# Altium schematic sheet uproc_main.SchDoc
size 863 x 558 mm
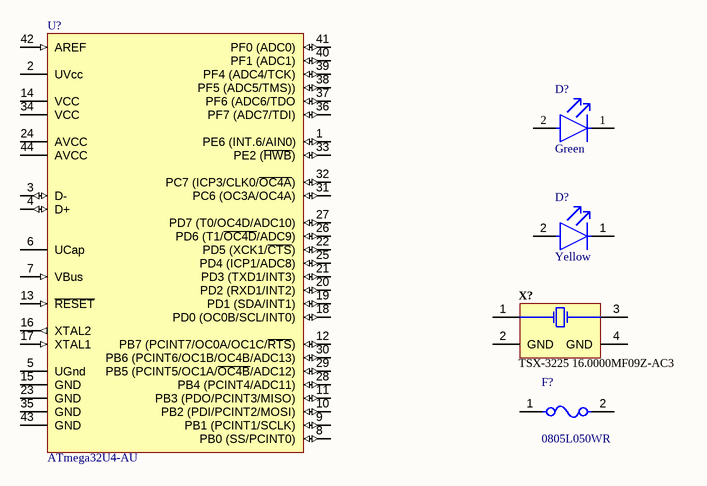
[diagram p0: uproc_main.SchDoc]

## Parts
(Parts that share a designator on the sheet are numbered #1, #2 ... from top to bottom, then left to right.)
D?#1  Green  [FP-LTST-C191KGKT-MFG]
D?#2  Yellow  [FP-LTST-C191KSKT-MFG]
F?  0805L050WR  [FP-0805L-MFG]
U?  ATmega32U4-AU  [44ML_M]
X?  TSX-3225 16.0000MF09Z-AC3  [EPSON-TSX-3225_V]

## Nets

Not connected (* = marked no-connect by the designer): D?#1 1(C) 2(A); D?#2 1(C) 2(A); F? 1 2; U? 1(PE6_(INT.6/AIN0)) 2(UVcc) 3(D-) 4(D+) 5(UGnd) 6(UCap) 7(VBus) 8(PB0_(SS/PCINT0)) 9(PB1_(PCINT1/SCLK)) 10(PB2_(PDI/PCINT2/MOSI)) 11(PB3_(PDO/PCINT3/MISO)) 12(PB7_(PCINT7/OC0A/OC1C/~{RTS})) 13(~{RESET}) 14(VCC) 15(GND) 16(XTAL2) 17(XTAL1) 18(PD0_(OC0B/SCL/INT0)) 19(PD1_(SDA/INT1)) 20(PD2_(RXD1/INT2)) 21(PD3_(TXD1/INT3)) 22(PD5_(XCK1/~{CTS})) 23(GND) 24(AVCC) 25(PD4_(ICP1/ADC8)) 26(PD6_(T1/~{OC4D}/ADC9)) 27(PD7_(T0/OC4D/ADC10)) 28(PB4_(PCINT4/ADC11)) 29(PB5_(PCINT5/OC1A/~{OC4B}/ADC12)) 30(PB6_(PCINT6/OC1B/OC4B/ADC13)) 31(PC6_(OC3A/OC4A)) 32(PC7_(ICP3/CLK0/~{OC4A})) 33(PE2_(~{HWB})) 34(VCC) 35(GND) 36(PF7_(ADC7/TDI)) 37(PF6_(ADC6/TDO) 38(PF5_(ADC5/TMS))) 39(PF4_(ADC4/TCK)) 40(PF1_(ADC1)) 41(PF0_(ADC0)) 42(AREF) 43(GND) 44(AVCC); X? 1(X1) 2(GND) 3(X2) 4(GND)

## Notes on the sheet
- DWG. NO.
- REV.
- SHT.
- REVISION
- DESCRIPTION
- DATE
- APPROVED
- THIS DOCUMENT AND THE DATA DISCLOSED HEREIN OR HEREWITH IS THE PROPERTY OF ALTIUM LIMITED AND MAY BE FREELY DISTRIBUTED IN WHOLE. NO RIGHTS ARE RESERVED OR EXPRESS OR IMPLIED WARANTEE GIVEN.
- ENG:
- DSN:
- APPROVALS
- PROJECT
- DOCUMENT REVISION:
- DESIGN ITEM:
- CHK:
- BOM:
- REFERENCE DOCUMENTS
- PROJECT REVISION:
- TITLE
- FAB DWG:
- PCB DWG:
- ASSY DWG:
- SCALE:
- SIZE
- D
- CAGE CODE
- FILE NAME
- DWG NO.
- SHEET
- OF
- REV

## Library data of the parts
D?#1 = CMP-2000-05198-4: LED GREEN CLEAR SMD; NexarPartId: 549907; Manufacturer: Vishay Lite-On; Manufacturer Part Number: LTST-C191KGKT; Forward Voltage: 2V; Viewing Angle: 130°; Power Rating: 75mW; Number of LEDs: 1; Luminous Intensity: 35mcd; Forward Current: 20mA; Dominant Wavelength: 571nm; Lens Color: Clear, Colorless; Reverse Voltage: 5V; Wavelength: 574nm; Description: Single Color LED, Ultra Bright Green, Water Clear, 1.1mm; Shape: Rectangular; Optoelectronic Device Type: SINGLE COLOR LED; Overall Height: 0.55mm; Number of Pins: 2; Lens Transparency: Clear; Packaging: Tape and Reel; Number of Elements: 1; Schedule B: 8541402000, 8541402000; Height: 550µm; Case/Package: 0603; Illumination Color: Green; Depth: 800µm; Max Operating Temperature: 85°C; RoHS: Compliant; Lens Style: Clear; Lead Free: Lead Free; Length: 1.6mm; Mount: Surface Mount; Test Current: 20mA; Width: 800µm; Case Code (Imperial): 0603; Min Operating Temperature: -55°C; Case Code (Metric): 1608; Radiation Hardening: No; Power Dissipation: 75mW; Color: Green; Supplier: Digikey; Supplier Part Number: 160-1446-1-ND; Stock: 1664852; Pricing: 1=0.15, 10=0.1, 100=0.0688, 500=0.05448, 1000=0.04972, 2000=0.04564, 5000=0.04116, 10000=0.03835, 15000=0.0369, 25000=0.03527, 35000=0.03429, 50000=0.03334, 125000=0.03124, 250000=0.02993 (USD); Mounting Technology: Surface Mount; Pins: 2; Color@wavelength: Green; Terminal Finish: Tin; Luminous Intensity-Nom: 35mcd; Channels: 1; JESD-609 Code: e3; Reverse Voltage-Max: 5V; Size: 1.1mm; Terminal Pitch: 1.5mm; Reach SVHC Compliant: Yes; RoHS Compliant: Yes; ComponentLink1URL: https://datasheet.ciiva.com:443/pdfs/VipMasterIC/IC/LITE/LITE-S-A0003156116/LITE-S-A0003156116-1.pdf?src-supplier=IHS+Markit; ComponentLink1Description: https://datasheet.ciiva.com:443/pdfs/VipMasterIC/IC/LITE/LITE-S-A0003156116/LITE-S-A0003156116-1.pdf?src-supplier=IHS+Markit; ComponentLink2URL: https://datasheet.ciiva.com/2109/ltst-c191kgkt-2109973.pdf?src-supplier=Digikey; ComponentLink2Description: https://datasheet.ciiva.com/2109/ltst-c191kgkt-2109973.pdf?src-supplier=Digikey
D?#2 = CMP-22017-000025-1: LED YELLOW CLEAR SMD; Manufacturer: Vishay Lite-On; Manufacturer Part Number: LTST-C191KSKT; Dominant Wavelength: 597nm; Power Rating: 75mW; Number of LEDs: 1; Lens Style: Diffused; Forward Current: 30mA; Test Current: 20mA; Forward Voltage: 2.4V; Wavelength: 588nm; Viewing Angle: 130°; Lens Color: Colorless; Reverse Voltage: 5V; Luminous Intensity: 180mcd; Description: Single Color LED, Yellow, Water Clear, 1.1mm; Shape: Rectangular; Optoelectronic Device Type: SINGLE COLOR LED; Luminous Intensity-Nom: 104mcd; Overall Height: 0.55mm; Case Code (Imperial): 0603; Width: 0.8mm; Power Dissipation: 75mW; Length: 1.6mm; Illumination Color: Yellow; Number of Pins: 2; Case Code (Metric): 1608; Mount: Surface Mount; Number of Elements: 1; Height: 0.55mm; Lens Transparency: Clear; Depth: 0.8mm; Min Operating Temperature: -55°C; Case/Package: 0603; Radiation Hardening: No; Max Operating Temperature: 85°C; Package Quantity: 1; Packaging: Tape and Reel; Lead Free: Lead Free; Color: Yellow; Supplier: Digikey; Supplier Part Number: 160-1448-1-ND; RoHS: Yes; Category: LEDs; Stock: 620459; Pricing: 1=0.15, 10=0.105, 100=0.0723, 500=0.05736, 1000=0.05238, 2000=0.04813, 5000=0.04344, 10000=0.0405, 15000=0.03899, 25000=0.03728, 35000=0.03627, 50000=0.03527, 125000=0.03308, 250000=0.03171 (USD); Mounting Technology: Surface Mount; Pins: 2; Color@wavelength: Yellow; Terminal Finish: Tin; JESD-609 Code: e3; Channels: 1; Reverse Voltage-Max: 5V; Size: 1.1mm; Terminal Pitch: 1.5mm; Reach SVHC Compliant: Yes; RoHS Compliant: Yes; ComponentLink1URL: https://datasheet.ciiva.com:443/pdfs/VipMasterIC/IC/LITE/LITE-S-A0008870965/LITE-S-A0008870965-1.pdf?src-supplier=IHS+Markit; ComponentLink1Description: https://datasheet.ciiva.com:443/pdfs/VipMasterIC/IC/LITE/LITE-S-A0008870965/LITE-S-A0008870965-1.pdf?src-supplier=IHS+Markit; ComponentLink2URL: https://datasheet.ciiva.com/12400/lite-on-ltst-c191kskt-190097-12400797.pdf?src-supplier=Mouser; ComponentLink2Description: https://datasheet.ciiva.com/12400/lite-on-ltst-c191kskt-190097-12400797.pdf?src-supplier=Mouser; ComponentLink3URL: https://datasheet.ciiva.com/11773/0900766b80dc02b3-11773512.pdf?src-supplier=Rs; ComponentLink3Description: https://datasheet.ciiva.com/11773/0900766b80dc02b3-11773512.pdf?src-supplier=Rs; ComponentLink4URL: https://datasheet.ciiva.com/16213/lite-on20ltst-c191kskt-16213725.pdf?src-supplier=Future+Electronics; ComponentLink4Description: https://datasheet.ciiva.com/16213/lite-on20ltst-c191kskt-16213725.pdf?src-supplier=Future+Electronics; ComponentLink5URL: https://datasheet.ciiva.com/15117/getdatasheetpartid-141495-15117732.pdf?src-supplier=Verical; ComponentLink5Description: https://datasheet.ciiva.com/15117/getdatasheetpartid-141495-15117732.pdf?src-supplier=Verical; ComponentLink6URL: https://datasheet.ciiva.com/2109/s-110-ltst-c191kskt-2109984.pdf?src-supplier=Digikey; ComponentLink6Description: https://datasheet.ciiva.com/2109/s-110-ltst-c191kskt-2109984.pdf?src-supplier=Digikey
F? = CMP-08606-000023-1: PTC RESET FUSE 6V 500MA 0805; Manufacturer: Littelfuse Inc.; Current Rating: 100A; Hold Current: 0.5A; Value: 0.15-0.85Ω; Trip Time: 0.1s; Trip Current: 1A; Device Class L2: PTC Resettable Fuses; Manufacturer Part Number: 0805L050WR; Digikey Description: PTC RESET FUSE 6V 500MA 0805; ComponentLink2URL: https://www.littelfuse.com/~/media/electronics/datasheets/resettable_ptcs/littelfuse_ptc_0805l_datasheet.pdf.pdf; Package: 0805L; RoHS: TRUE; Temperature Range Low: -40°C; Octopart: https://octopart.com/0805l050wr-littelfuse-673858; Resistance: 0.15-0.85Ω; ComponentLink2Description: Datasheet; Category: Fuse; Height: 1.25mm; Mouser Description: PTC Resettable Fuse 0.5A(hold) 1A(trip) 6VDC 100A 0.5W 0.1s 0.15Ohm SMD Solder Pad 0805 T/R; Ambient Temperature Range High: +85°C; Automotive: No; Device Class L3: unset; Lead Free: Yes; Temperature: -40°C to +85°C; Voltage Rating: 6V; Ambient Temperature Range Low: -40°C; Temperature Range High: +85°C; Device Class L1: Circuit Protection
U? = CMP-0095-00285-2: 8-bit AVR Microcontroller, 2.7-5.5V, 16MHz, 32KB Flash, 1KB EEPROM, 2.5KB SRAM, USB Controller, 44-pin TQFP, Industrial Grade (-40°C to 85°C), Ext Osc; Manufacturer: Microchip; Description: RISC Microcontroller, 8-Bit, FLASH, AVR RISC CPU, 16MHz, CMOS, PQFP44; Package Body Material: Plastic; Number of I/O Lines: 26; Package Equivalence Code: TQFP44,.47SQ,32; Power Supplies: 3/5; Max Supply Current: 15mA; Max Supply Voltage: 5.5V; Min Supply Voltage: 4.5V; Nominal Supply Voltage: 5V; Peripherals: POR,PWM,WDT; Interface: SPI,USB,USART; Qualification Status: Not Qualified; RevisionNote: DatasheetVersion updated. URLs added.; ComponentLink1Description: Manufacturer URL; PackageDescription: 44-Pin Plastic Thin Quad Flat Pack, 10 x 10 x 1.0 mm Body, 0.8 mm Pitch (TQFP); DatasheetVersion: revF, Nov-2010; ComponentLink2URL: http://www.atmel.com/dyn/resources/prod_documents/doc7766.pdf; ComponentLink1URL: http://www.atmel.com/; PackageReference: 44ML; ComponentLink2Description: ATmega16U4/32U4 Datasheet; PackageVersion: rev.G, Jul-2007; ComponentLink3URL: http://www.atmel.com/dyn/resources/prod_documents/7766S.pdf; ComponentLink3Description: ATmega16U4 ATmega32U4 Summary; MPN: ATmega32U4-AU; Supplier: Digikey; Supplier Part Number: ATMEGA32U4-AU-ND; Manufacturer Part Number: ATMEGA32U4-AU; RoHS: Yes; Stock: 9921; Pricing: 1=5.29, 25=4.84, 100=4.39 (USD); Case/Package: TQFP; Pins: 44; Package Shape: Square; Min Operating Temperature: -40°C; Max Operating Temperature: 85°C; Clock Frequency: 16MHz; JESD-30 Code: S-PQFP-G44; Surface Mount: Yes; Technology: CMOS; Terminal Form: Gull Wing; Terminal Position: QUAD; Length: 10mm; Width: 10mm; Height - Seated (Max): 1.2mm; Terminal Pitch: 0.8mm; RoHS Compliant: Yes; Reach SVHC Compliant: Yes; Temperature Grade: INDUSTRIAL; ComponentLink4URL: https://datasheet.ciiva.com:443/pdfs/VipMasterIC/IC/ATML/ATML-S-A0001723807/ATML-S-A0001723807-1.pdf?src-supplier=IHS+Markit; ComponentLink4Description: https://datasheet.ciiva.com:443/pdfs/VipMasterIC/IC/ATML/ATML-S-A0001723807/ATML-S-A0001723807-1.pdf?src-supplier=IHS+Markit; ComponentLink5URL: https://datasheet.ciiva.com/22651/1684411-22651233.pdf?src-supplier=Farnell; ComponentLink5Description: https://datasheet.ciiva.com/22651/1684411-22651233.pdf?src-supplier=Farnell; ComponentLink6URL: https://datasheet.ciiva.com/15122/getdatasheetpartid-116246-15122378.pdf?src-supplier=Verical; ComponentLink6Description: https://datasheet.ciiva.com/15122/getdatasheetpartid-116246-15122378.pdf?src-supplier=Verical; ComponentLink7URL: https://datasheet.ciiva.com/1157/1684411-1157762.pdf?src-supplier=Element14; ComponentLink7Description: https://datasheet.ciiva.com/1157/1684411-1157762.pdf?src-supplier=Element14
X? = CMP-2000-07331-1: Crystal, 16 MHz, -40 to 85 degC, 4-Pin SMD, RoHS, Tape and Reel; Manufacturer: Epson; ESR: 60Ohms; Brand: EpsonTiming; Load Capacitance: 9pF; Frequency: 16MHz; Frequency Stability: 10PPM; Unit Weight: 0.000564oz; Drive Level: 200uW; Description: Parallel - Fundamental Quartz Crystal, 16MHz Nom; Aging: 1 PPM/FIRST YEAR; Crystal/Resonator Type: PARALLEL - FUNDAMENTAL; Operating Frequency-Nom: 160; Factory Pack Quantity: 250; Mounting Style: SMD/SMT; Packaging: Reel; Datasheet URL: https://support.epson.biz/td/api/doc_check.php?dl=brief_FA-238V_en.pdf; Datasheet Version: 12/2015; Package Reference: TSX-3225; Series: TSX-3225; Package / Case: 3.2mmx2.5mm; Package Description: 4-Pin Surface Mount Device, Body 3.2 x 2.5 mm; Type: Crystal; Height: 0.6mm; Manufacturer URL: https://www.eea.epson.com/; Operating Temperature Range: -20Cto+75C; Length: 3.2mm; Width: 2.5mm; RoHS: True; Mounting Technology: SurfaceMount; Termination Style: SMD/SMT; Product Category: Crystals; Tolerance: 10PPM; Supplier: Digikey; Supplier Part Number: SER3628CT-ND; Manufacturer Part Number: TSX-322516.0000MF09Z-AC3; Category: Crystals; Stock: 73345; Pricing: 1=0.82, 10=0.714, 25=0.6748, 50=0.647, 100=0.6202, 250=0.49856, 500=0.47792, 750=0.46627, 1250=0.45198, 1750=0.44281, 2500=0.43329, 3000=0.42851, 6000=0.41081, 6250=0.40979 (USD); Terminal Finish: Nickel; Min Operating Temperature: -20°C; Max Operating Temperature: 75°C; JESD-609 Code: e4; Additional Feature: TAPE AND REEL; Frequency Tolerance: 10ppm; RoHS Compliant: Yes; Reach SVHC Compliant: Yes; ComponentLink1URL: https://datasheet.ciiva.com:443/pdfs/VipMasterIC/IC/SEIK/SEIKS02827/SEIKS02827-1.pdf?src-supplier=IHS+Markit; ComponentLink1Description: https://datasheet.ciiva.com:443/pdfs/VipMasterIC/IC/SEIK/SEIKS02827/SEIKS02827-1.pdf?src-supplier=IHS+Markit; ComponentLink2URL: https://www5.epsondevice.com/en/information/support/pdf/june_2018_psc_masterbook.pdf?src-supplier=Digikey; ComponentLink2Description: https://www5.epsondevice.com/en/information/support/pdf/june_2018_psc_masterbook.pdf?src-supplier=Digikey; ComponentLink3URL: http://datasheet.octopart.com/TSX-3225-16.0000MF09Z-AC3-Epson-datasheet-61114919.pdf?src-supplier=Future+Electronics; ComponentLink3Description: http://datasheet.octopart.com/TSX-3225-16.0000MF09Z-AC3-Epson-datasheet-61114919.pdf?src-supplier=Future+Electronics; ComponentLink4URL: http://www5.epsondevice.com/en/products/crystal_unit/tsx3225.html#?src-supplier=Mouser; ComponentLink4Description: http://www5.epsondevice.com/en/products/crystal_unit/tsx3225.html#?src-supplier=Mouser; ComponentLink5URL: http://datasheet.octopart.com/TSX-3225-16.0000MF09Z-AC3-Epson-datasheet-61114919.pdf?src-supplier=Verical; ComponentLink5Description: http://datasheet.octopart.com/TSX-3225-16.0000MF09Z-AC3-Epson-datasheet-61114919.pdf?src-supplier=Verical; ComponentLink6URL: https://datasheet.octopart.com/TSX-3225-16.0000MF09Z-AC3-Epson-datasheet-141944207.pdf?src-supplier=Arrow.cn; ComponentLink6Description: https://datasheet.octopart.com/TSX-3225-16.0000MF09Z-AC3-Epson-datasheet-141944207.pdf?src-supplier=Arrow.cn